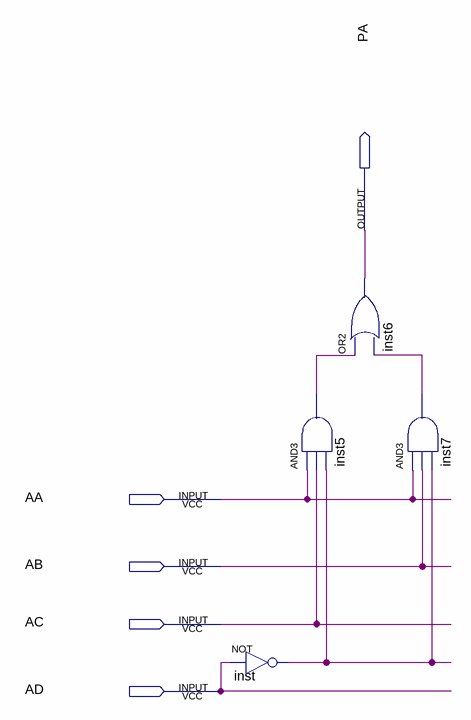
[diagram p0: schematic sheet]
// Quartus schematic ColunaA.bdf as structural Verilog: 4 symbols, 5 pins
module ColunaA (
  input  AA,
  input  AB,
  input  AC,
  input  AD,
  output PA
);

  wire inst5_out, inst7_out, inst_out;

  not inst (inst_out, AD);
  and inst5 (inst5_out, AA, AC, inst_out);
  or inst6 (PA, inst5_out, inst7_out);
  and inst7 (inst7_out, AA, AB, inst_out);
endmodule
